# EAGLE design TRS (EAGLE 6.5.0)
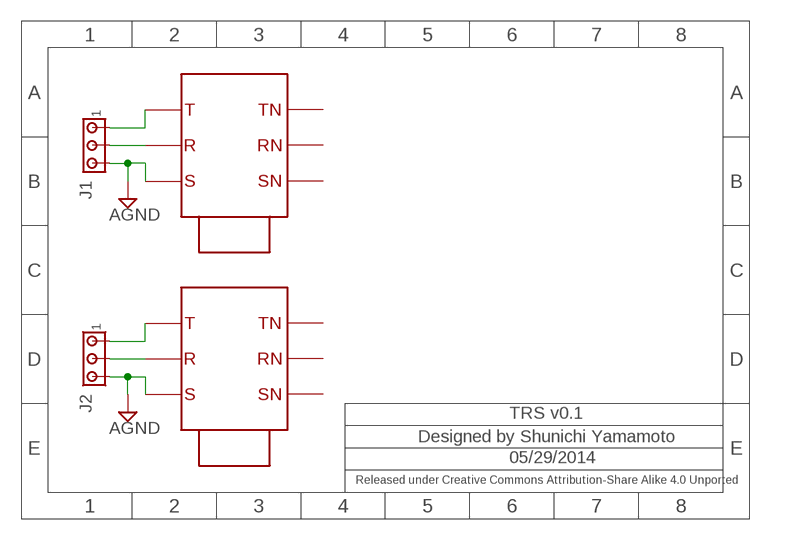
[diagram p0: schematic, sheet 1]

## Parts
J1  MTA03-100  [10X03MTA]
J2  MTA03-100  [10X03MTA]
X1  NMJ6HFD2  [NMJ6HFD2]
X2  NMJ6HFD2  [NMJ6HFD2]

## Nets
AGND: J1.3 J2.3 X1.GND-IN X2.GND-IN
N$1: J1.1 X1.LEFT-IN
N$2: J1.2 X1.RIGHT-IN
N$3: J2.1 X2.LEFT-IN
N$4: J2.2 X2.RIGHT-IN
Unconnected: X1.GND-OUT X1.LEFT-OUT X1.RIGHT-OUT X2.GND-OUT X2.LEFT-OUT X2.RIGHT-OUT

## Notes on the sheet
- TRS v0.1
- Designed by Shunichi Yamamoto
- 05/29/2014
- Released under Creative Commons Attribution-Share Alike 4.0 Unported

## Library data of the parts
J1 J2 = con-amp:MTA03-100: AMP connector
X1 X2 = Neutrik:NMJ6HFD2

## Board
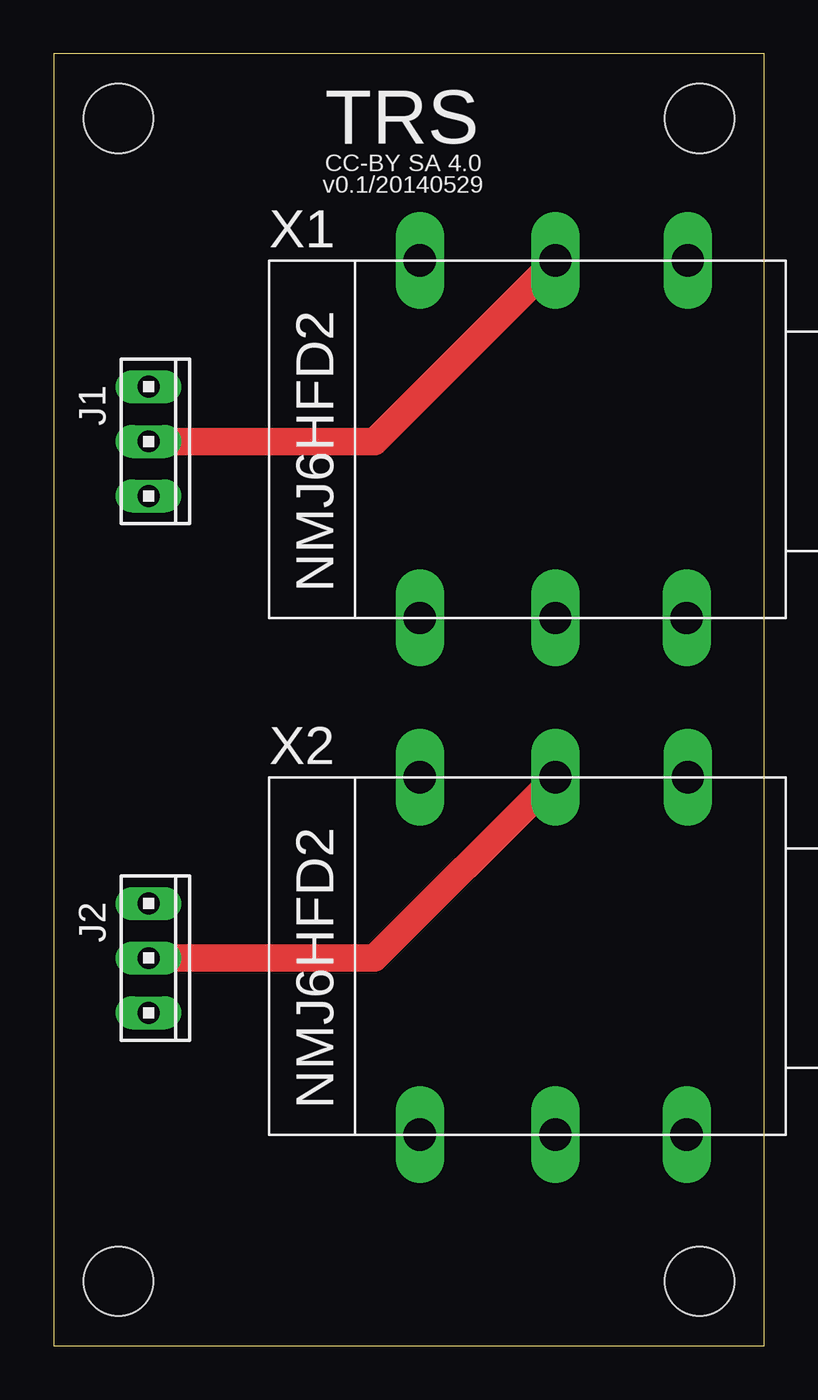
[diagram p1: board, top side]
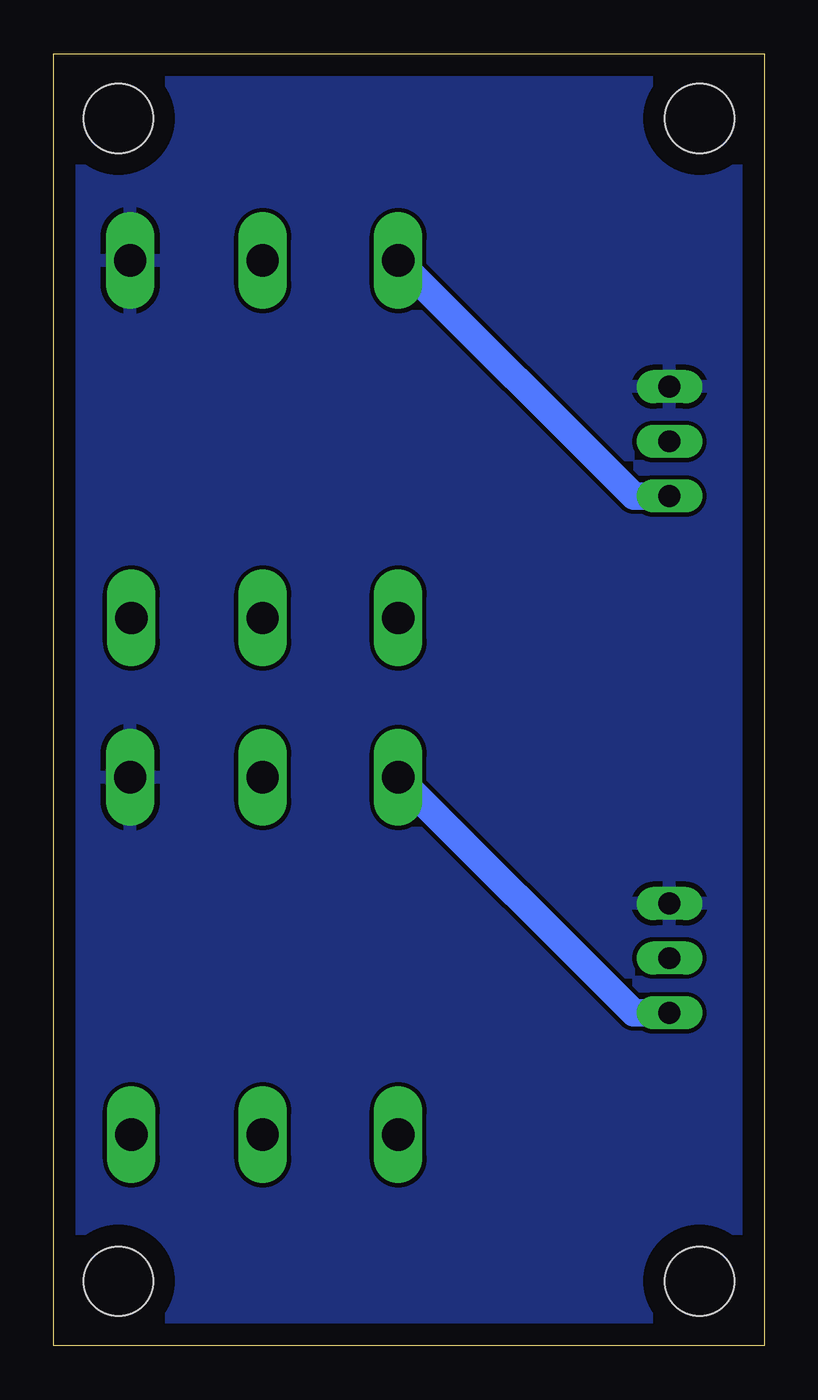
[diagram p2: board, bottom side, seen from below]

Size 33 x 60 mm. Coordinates in mm from the lower left corner, seen from the top.
Outline: 0,0 33,0 33,60 0,60 0,0
Copper layers (1*16): Top 0.035mm / dielectric 1.5mm / Bottom 0.035mm
Design rules "default": minimum track width 10mil, minimum drill 24mil, track to track 8mil, track to pad 8mil, pad to pad 8mil, via to via 8mil, smd to smd 8mil, copper to edge 40mil, drill to drill 8mil, minimum pad ring 10mil, minimum via ring 8mil, stop-mask expansion 4mil, vias tented up to drill 0mil, thermal gap 10mil
Holes 3.2 mm at 3,3 3,57 30,57 30,3

### Footprints (pad centres in the part's own frame; a part is rotated, then mirrored left to right if it is on the bottom)
10X03MTA = drill 1.016 long: 1 2.54,0; 2 0,0; 3 -2.54,0
NMJ6HFD2 = drill 1.5 long: GND-IN -8.4,19.45; GND-OUT 8.2,19.4; LEFT-IN -8.4,7; LEFT-OUT 8.2,7; RIGHT-IN -8.4,13.3; RIGHT-OUT 8.2,13.3

### Placement (x,y rotation side)
J1  4.4,42 270 top
J2  4.4,18 270 top
X1  10,42 270 top
X2  10,18 270 top

### Tracks (layer width: path | path; a pad name or v marks a point on that pad's centre or on a via)
AGND
  pour Bottom: 0,0 33,0 33,60 0,60
N$1
  Bottom 1.27: J1.1 6.06,39.46 X1.LEFT-IN
N$2
  Top 1.27: J1.2 14.9,42 X1.RIGHT-IN
N$3
  Bottom 1.27: J2.1 6.06,15.46 X2.LEFT-IN
N$4
  Top 1.27: J2.2 14.9,18 X2.RIGHT-IN

### Text on the board
tNames: TRS | CC-BY SA 4.0 | v0.1/20140529 | X1 | NMJ6HFD2 | X2 | NMJ6HFD2